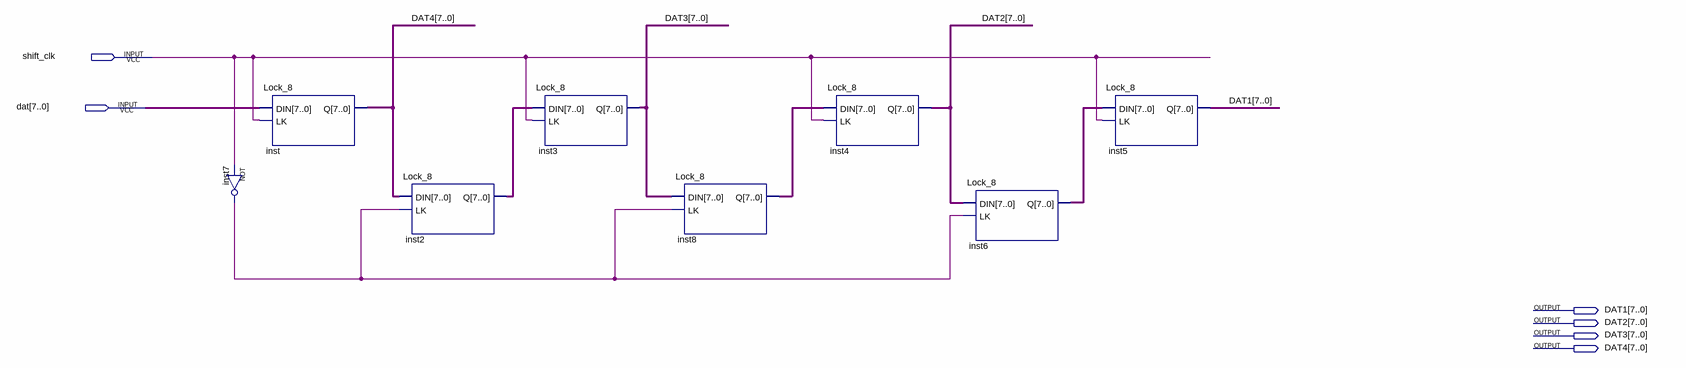
[diagram p0: schematic sheet]
// Quartus schematic READ_FLASH.bdf as structural Verilog: 8 symbols, 6 pins
module READ_FLASH (
  input  shift_clk,
  input  [7:0] dat,
  output [7:0] DAT1,
  output [7:0] DAT2,
  output [7:0] DAT3,
  output [7:0] DAT4
);

  wire inst7_out;
  wire [7:0] inst2_q, inst6_q, inst8_q;

  not inst7 (inst7_out, shift_clk);
  Lock_8 inst (.DIN(dat), .LK(shift_clk), .Q(DAT4));
  Lock_8 inst2 (.DIN(DAT4), .LK(inst7_out), .Q(inst2_q));
  Lock_8 inst3 (.DIN(inst2_q), .LK(shift_clk), .Q(DAT3));
  Lock_8 inst8 (.DIN(DAT3), .LK(inst7_out), .Q(inst8_q));
  Lock_8 inst4 (.DIN(inst8_q), .LK(shift_clk), .Q(DAT2));
  Lock_8 inst6 (.DIN(DAT2), .LK(inst7_out), .Q(inst6_q));
  Lock_8 inst5 (.DIN(inst6_q), .LK(shift_clk), .Q(DAT1));
endmodule
